# EAGLE design hv80_carrier (EAGLE 7.5.0)
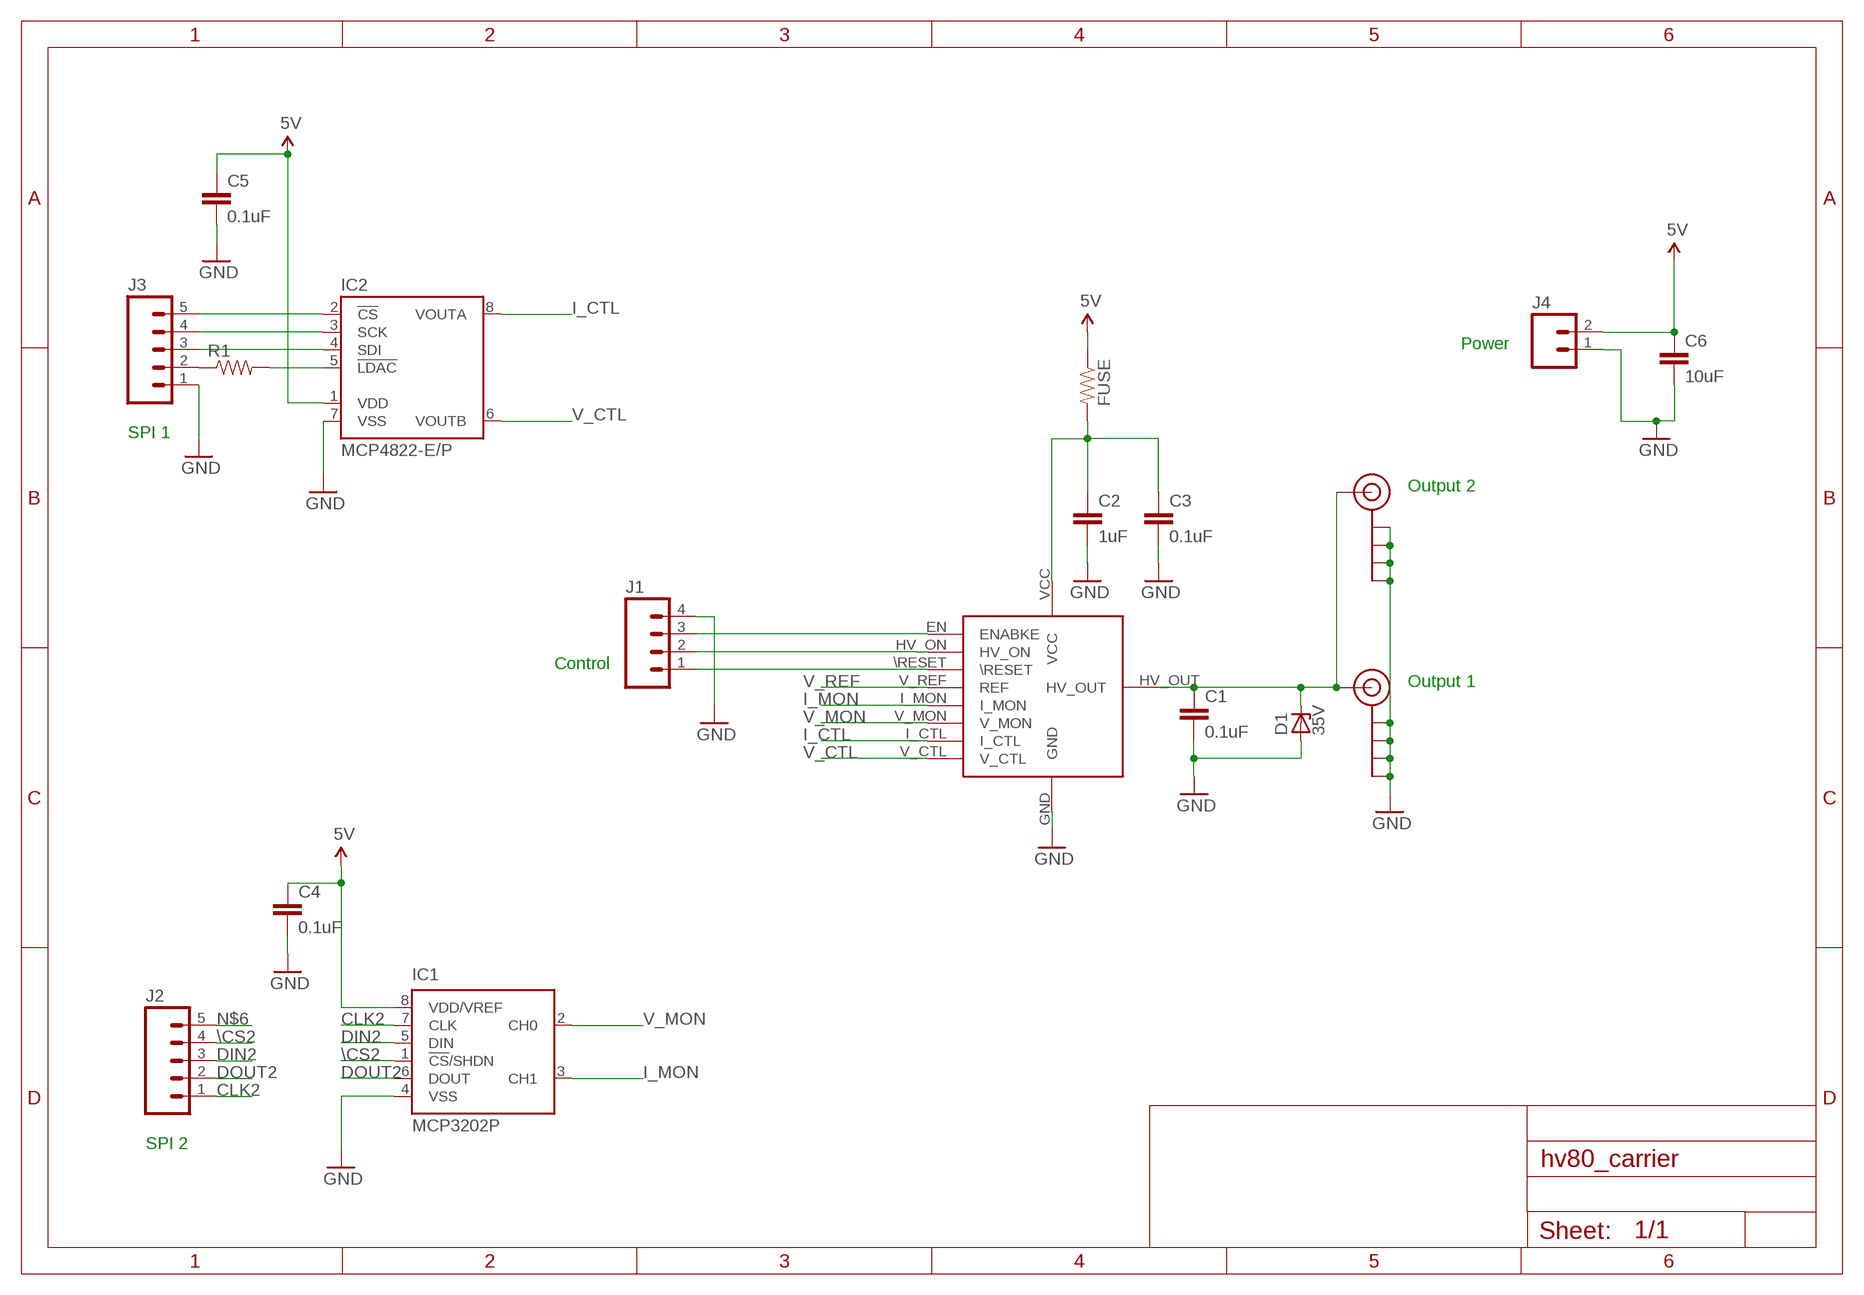
[diagram p0: schematic, sheet 1]

## Parts
C1  0.1uF  CAP1206  [1206]
C2  1uF  CAP1206  [1206]
C3  0.1uF  CAP1206  [1206]
C4  0.1uF  CAP1206  [1206]
C5  0.1uF  CAP1206  [1206]
C6  10uF  CAP1206  [1206]
D1  35V  ZENER-DIODEDO41Z10  [DO41Z10]
FUSE  RESISTORPTH-1/4W  [AXIAL-0.4]
IC1  MCP3202P  [DIL8]
IC2  MCP4822-E/P  [DIL08]
J1  M04PTH  [1X04]
J2  M05PTH  [1X05]
J3  M05PTH  [1X05]
J4  M023.5MM  [SCREWTERMINAL-3.5MM-2]
J$1  SMA_EDGE  [SMA-EDGE]
J$2  SMA_EDGE  [SMA-EDGE]
R1  RESISTORPTH-1/4W  [AXIAL-0.4]
U$1  HV80  [HV80]

## Nets
5V: C4.1 C5.1 C6.1 FUSE.P$1 IC1.8(VDD/VREF) IC2.1(VDD) J4.2
\CS1: IC2.2(!CS) J3.5
\CS2: IC1.1(!CS!/SHDN) J2.4
CLK2: IC1.7(CLK) J2.1
DIN2: IC1.5(DIN) J2.3
DOUT2: IC1.6(DOUT) J2.2
GND: C1.2 C2.2 C3.2 C4.2 C5.2 C6.2 D1.A IC1.4(VSS) IC2.7(VSS) J1.4 J3.1 J4.1 J$1.GND@0(GND) J$1.GND@1(GND) J$1.GND@2(GND) J$1.GND@3(GND) J$2.GND@0(GND) J$2.GND@1(GND) J$2.GND@2(GND) J$2.GND@3(GND) U$1.GND
I_CTL: IC2.8(VOUTA) U$1.I_CTL
I_MON: IC1.3(CH1) U$1.I_MON
N$1: J1.1 U$1.\RESET
N$2: J1.2 U$1.HV_ON
N$3: J1.3 U$1.EN(ENABKE)
N$4: C1.1 D1.C J$1.SIG(SIGNAL) J$2.SIG(SIGNAL) U$1.HV_OUT
N$5: J3.2 R1.P$1
N$6: J2.5
N$7: IC2.5(!LDAC) R1.P$2
N$9: C2.1 C3.1 FUSE.P$2 U$1.VCC
SCK1: IC2.3(SCK) J3.4
SDI1: IC2.4(SDI) J3.3
V_CTL: IC2.6(VOUTB) U$1.V_CTL
V_MON: IC1.2(CH0) U$1.V_MON
V_REF: U$1.V_REF(REF)

## Notes on the sheet
- Power
- SPI 1
- Output 2
- Control
- Output 1
- SPI 2

## Library data of the parts
C1-C6 = SparkFun-Passives:CAP: Capacitor Standard 0603 ceramic capacitor, and 0.1" leaded capacitor.
D1 = diode:ZENER-DIODE: Z-Diode
FUSE R1 = SparkFun-Resistors:RESISTOR: Resistor Basic schematic elements and footprints for 0603, 1206, and PTH resistors.
IC1 = microchip:MCP3202: 2.7V Dual Channel 12-Bit A/D Converter with SPI Serial Interface Source: http://ww1.microchip.com/downloads/en/DeviceDoc/21034D.pdf; MF: MICROCHIP; MPN: MCP3202-CI/P; OC_FARNELL: 1196794; OC_NEWARK: 72K7287
IC2 = HV80:MCP4822: Microchip MCP4822 According to datasheet http://ww1.microchip.com/downloads/en/DeviceDoc/22249A.pdf. Created by Nils Hintze <n.hintze@elektronikpage.net>
J1 = SparkFun-Connectors:M04: Header 4 Standard 4-pin 0.1" header. Use with straight break away headers (SKU : PRT-00116), right angle break away headers (PRT-00553), swiss pins (PRT-00743), machine pins (PRT-00117), and female headers (PRT-00115). Molex polarized connector foot print use with SKU : PRT-08231 with associated crimp pins and housings. 1MM SMD Version SKU: PRT-10208; PROD_ID: CONN-09696
J2 J3 = SparkFun-Connectors:M05: Header 5 Standard 5-pin 0.1" header. Use with straight break away headers (SKU : PRT-00116), right angle break away headers (PRT-00553), swiss pins (PRT-00743), machine pins (PRT-00117), and female headers (PRT-00115). Molex polarized connector foot print use with SKU : PRT-08230 with associated crimp pins and housings.
J4 = SparkFun-Connectors:M02: Standard 2-pin 0.1" header. Use with - straight break away headers ( PRT-00116) - right angle break away headers (PRT-00553) - swiss pins (PRT-00743) - machine pins (PRT-00117) - female headers (PRT-00115) Molex polarized connector foot print use with: PRT-08233 with associated crimp pins and housings. 2.54_SCREWTERM for use with PRT-10571. 3.5mm Screw Terminal footprints for PRT-08084 5mm Screw Terminal footprints for use with PRT-08432; PROD_ID: CONN-08399
J$1 J$2 = SparkFun-Connectors:SMA_EDGE: SMA Antenna Connector End launch SMA connector. The paste layer has been removed so that the connector can be hand soldered onto the board after reflow.
U$1 = HV80:HV80

## Board
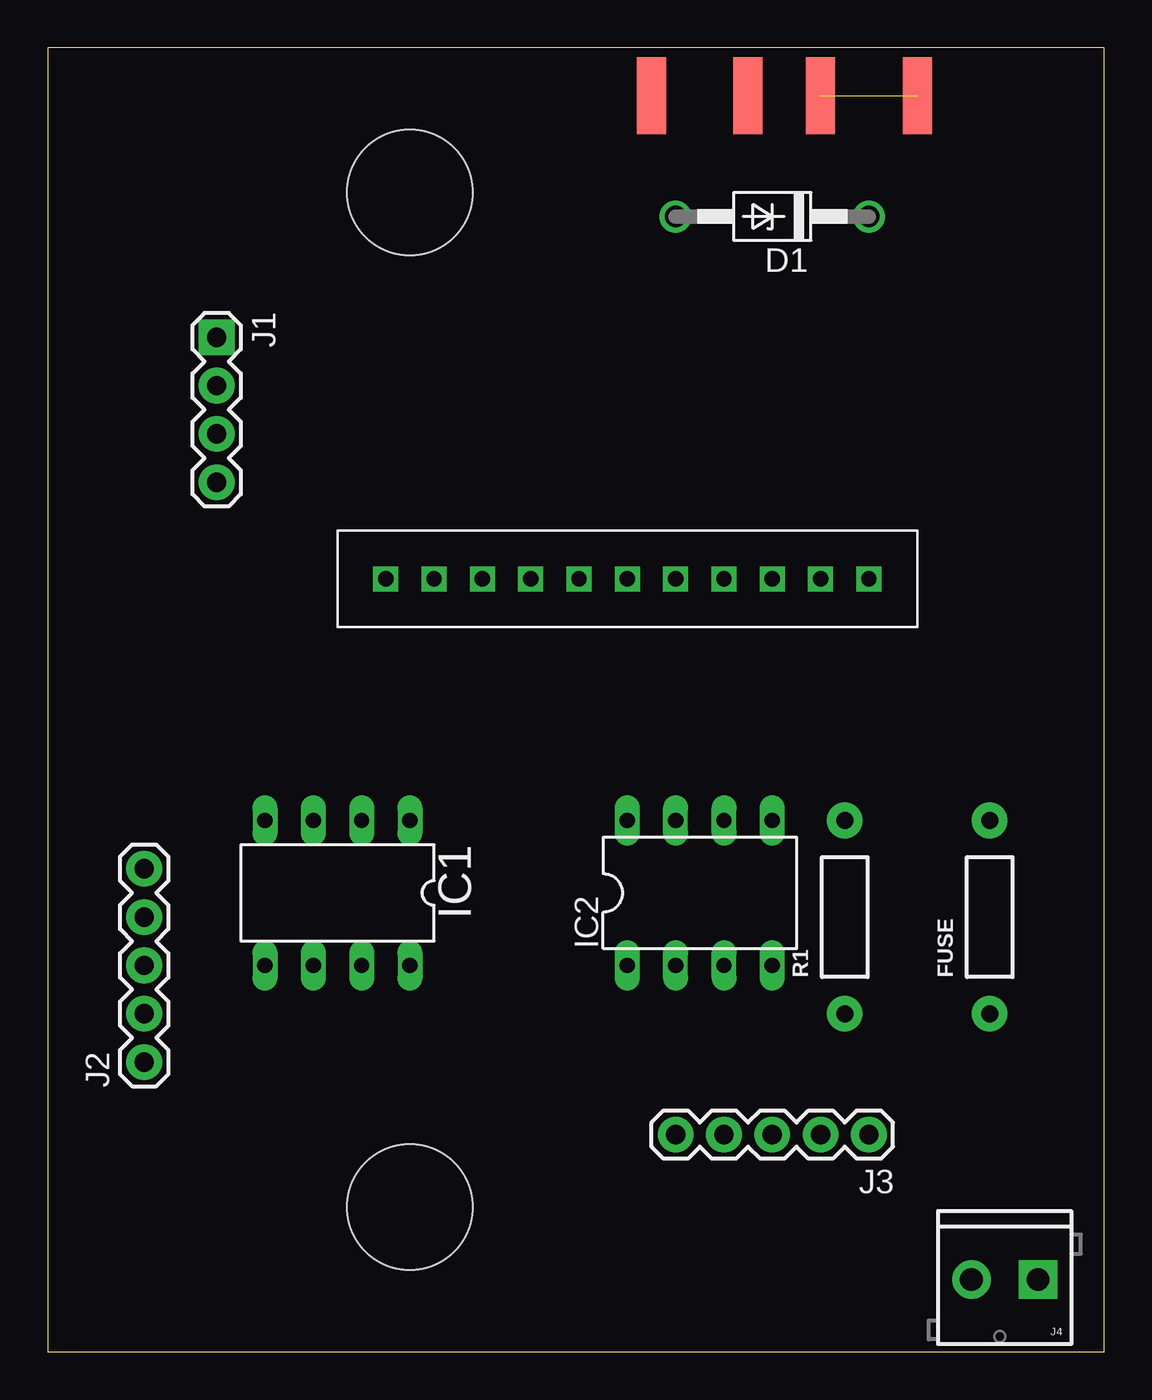
[diagram p1: board, top side]
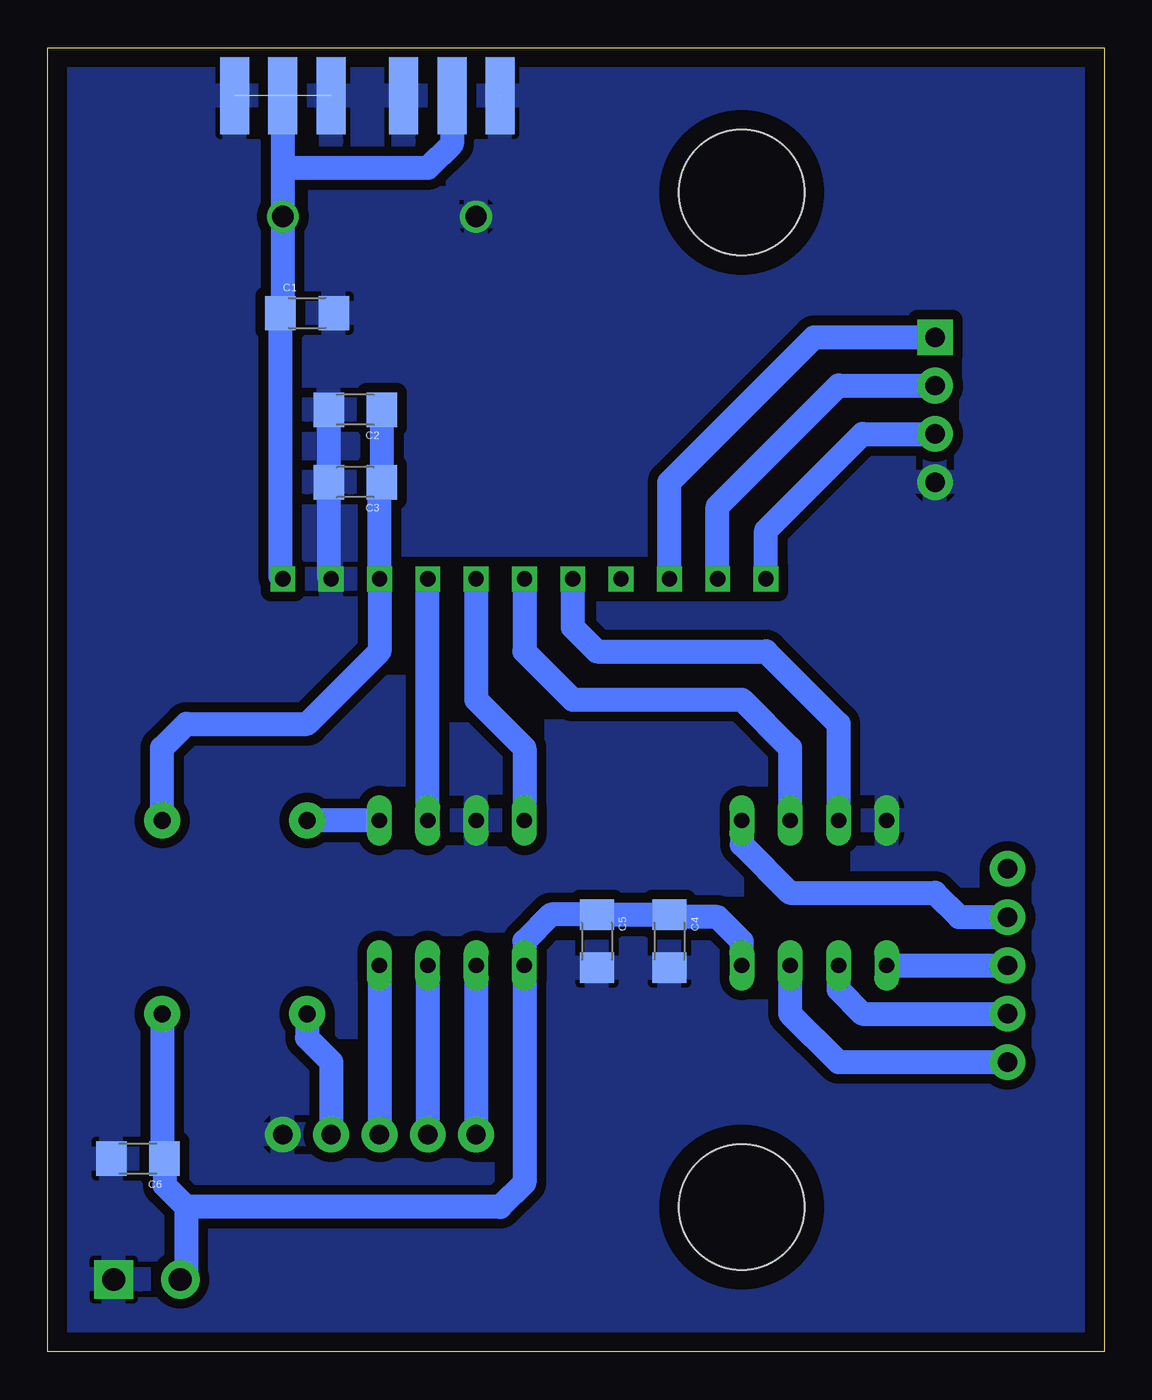
[diagram p2: board, bottom side, seen from below]

Size 55.55 x 68.57 mm. Coordinates in mm from the lower left corner, seen from the top.
Outline: 0,0 55.55,0 55.55,68.57 0,68.57 0,0
Copper layers (1*16): Top 0.035mm / dielectric 1.5mm / Bottom 0.035mm
Design rules "default *": minimum track width 10mil, minimum drill 24mil, track to track 20mil, track to pad 20mil, pad to pad 20mil, via to via 20mil, smd to smd 20mil, copper to edge 40mil, drill to drill 8mil, minimum pad ring 10mil, minimum via ring 8mil, stop-mask expansion 4mil, vias tented up to drill 0mil, thermal gap 10mil
Holes 6.6 mm at 19.05,60.96 19.05,7.62

### Footprints (pad centres in the part's own frame; a part is rotated, then mirrored left to right if it is on the bottom)
1206 = smd 1.6 x 1.8: 1 -1.4,0; 2 1.4,0
DO41Z10 = drill 1.118: A 5.08,0; C -5.08,0
AXIAL-0.4 = drill 0.9 pad 1.88: P$1 -5.08,0; P$2 5.08,0
DIL8 = drill 0.813 long: 1 -3.81,-3.81; 2 -1.27,-3.81; 3 1.27,-3.81; 4 3.81,-3.81; 5 3.81,3.81; 6 1.27,3.81; 7 -1.27,3.81; 8 -3.81,3.81
DIL08 = drill 0.813 long: 1 -3.81,-3.81; 2 -1.27,-3.81; 3 1.27,-3.81; 4 3.81,-3.81; 5 3.81,3.81; 6 1.27,3.81; 7 -1.27,3.81; 8 -3.81,3.81
1X04 = drill 1.016 pad 1.88 square: 1 0,0 | drill 1.016 pad 1.88: 2 2.54,0; 3 5.08,0; 4 7.62,0
1X05 = drill 1.016 pad 1.88: 1 0,0; 2 2.54,0; 3 5.08,0; 4 7.62,0; 5 10.16,0
SCREWTERMINAL-3.5MM-2 = drill 1.2 pad 2.032 square: 1 0,0 | drill 1.2 pad 2.032: 2 3.5,0
SMA-EDGE = smd 1.524 x 4.064: GND@0 0,0; GND@1 5.08,0; SIG 2.54,0 | smd 1.524 x 4.064 bottom: GND@2 0,0; GND@3 5.08,0
HV80 = drill 0.8 square: \RESET 5.08,0; EN 0,0; GND 22.86,0; HV_ON 2.54,0; HV_OUT 25.4,0; I_CTL 15.24,0; I_MON 10.16,0; V_CTL 17.78,0; V_MON 12.7,0; V_REF 7.62,0; VCC 20.32,0

### Placement (x,y rotation side)
C1  41.91,54.61 0 bottom
C2  39.37,49.53 180 bottom
C3  39.37,45.72 180 bottom
C4  22.86,21.59 270 bottom
C5  26.67,21.59 270 bottom
C6  50.8,10.16 180 bottom
D1  38.1,59.69 180 top
FUSE  49.53,22.86 90 top
IC1  15.24,24.13 180 top
IC2  34.29,24.13 0 top
J1  8.89,53.34 270 top
J2  5.08,15.24 90 top
J3  43.18,11.43 180 top
J4  52.07,3.81 180 top
J$1  45.72,66.04 0 bottom
J$2  36.83,66.04 0 bottom
R1  41.91,22.86 90 top
U$1  17.78,40.64 0 top

### Tracks (layer width: path | path; a pad name or v marks a point on that pad's centre or on a via)
5V
  Bottom 1.27: IC1.8 19.05,21.59 20.32,22.86 22.73,22.86 C4.1 C5.1 29.08,22.99 30.48,21.59 IC2.1 30.48,8.89 31.75,7.62 48.26,7.62 | 48.26,7.62 49.4,8.76 C6.1 49.53,10.29 FUSE.P$1 | 48.26,7.62 48.26,4.12 J4.2
\CS1
  Bottom 1.27: IC2.2 J3.5
\CS2
  Bottom 1.27: IC1.1 19.05,26.67 16.51,24.13 8.89,24.13 7.62,22.86 J2.4
CLK2
  Bottom 1.27: IC1.7 16.51,17.78 13.97,15.24 J2.1
DIN2
  Bottom 1.27: IC1.5 J2.3
DOUT2
  Bottom 1.27: IC1.6 13.97,19.05 12.7,17.78 J2.2
GND  (5 unrouted)
  Bottom 1.27: C2.2 C3.2 40.77,40.77 U$1.GND
  pour Bottom: 0,68.58 0,0 55.88,0 55.88,68.58
I_CTL
  Bottom 1.27: U$1.I_CTL 33.02,34.29 30.48,31.75 IC2.8
I_MON
  Bottom 1.27: U$1.I_MON 27.94,38.1 26.67,36.83 17.78,36.83 13.97,33.02 IC1.3
N$1
  Bottom 1.27: U$1.\RESET 22.86,45.72 15.24,53.34 J1.1
N$2
  Bottom 1.27: U$1.HV_ON 20.32,44.45 13.97,50.8 J1.2
N$3
  Bottom 1.27: U$1.EN 17.78,43.18 12.7,48.26 J1.3
N$4
  Bottom 1.27: J$1.SIG 43.18,62.23 | 43.18,62.23 D1.C 43.18,54.74 C1.1 43.31,40.77 U$1.HV_OUT | J$2.SIG 34.29,63.5 35.56,62.23 43.18,62.23
N$5
  Bottom 1.27: R1.P$1 41.91,16.51 40.64,15.24 J3.2
N$7
  Bottom 1.27: IC2.5 R1.P$2
N$9
  Bottom 1.27: C2.1 C3.1 38.1,45.59 U$1.VCC 38.1,36.83 41.91,33.02 48.26,33.02 49.53,31.75 FUSE.P$2
SCK1
  Bottom 1.27: IC2.3 J3.4
SDI1
  Bottom 1.27: IC2.4 J3.3
V_CTL
  Bottom 1.27: IC2.6 U$1.V_CTL
V_MON
  Bottom 1.27: U$1.V_MON 30.48,36.83 27.94,34.29 19.05,34.29 16.51,31.75 IC1.2